# EAGLE design Sleep Lamp (EAGLE 8.2.2)
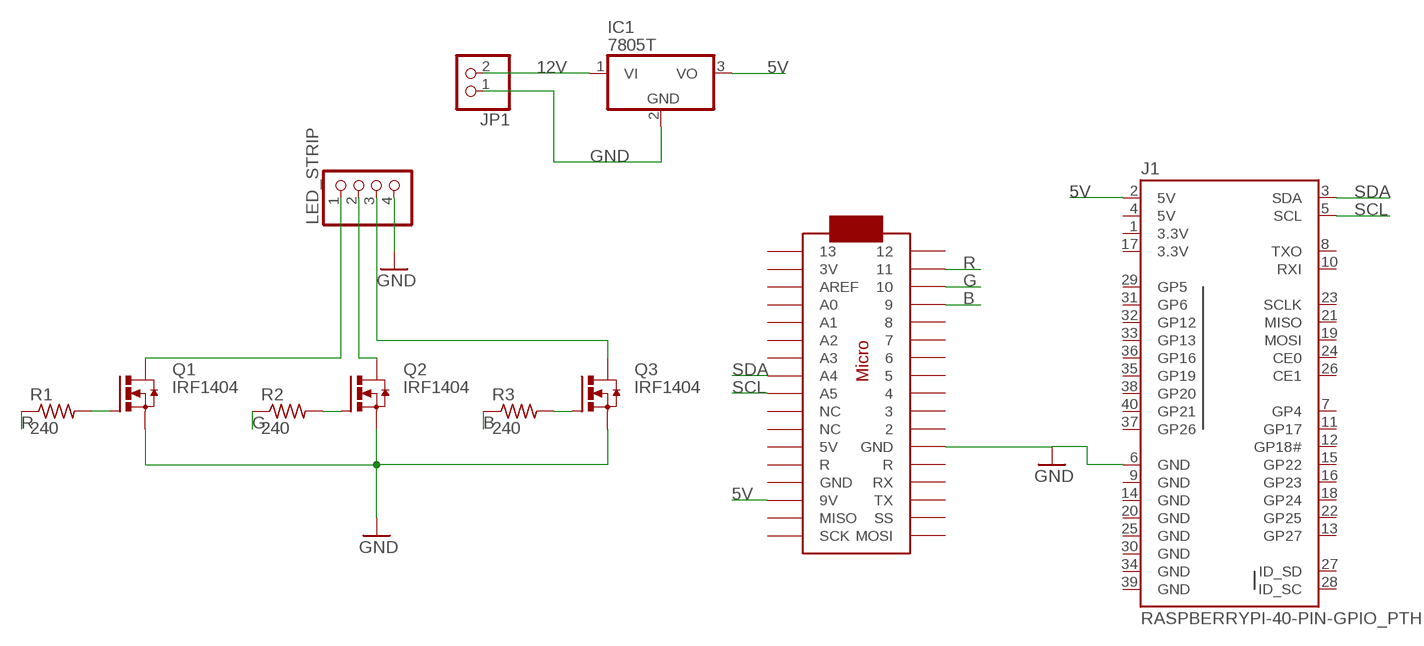
[diagram p0: schematic, sheet 1]

## Parts
IC1  7805T  [TO220H]
J1  RASPBERRYPI-40-PIN-GPIO_PTH  [2X20_SHROUDED]
JP1  PINHD-1X2  [1X02]
LED_STRIP  PINHD-1X4  [1X04]
Q1  IRF1404  IRFI540NPBF  [TO220BH]
Q2  IRF1404  IRFI540NPBF  [TO220BH]
Q3  IRF1404  IRFI540NPBF  [TO220BH]
R1  240  R-US_0204/7  [0204/7]
R2  240  R-US_0204/7  [0204/7]
R3  240  R-US_0204/7  [0204/7]
U$1  ARDUINOMICRO  [ARDUINOMICRO]

## Nets
5V: IC1.3(VO) J1.2(5V) U$1.P$20(9V)
12V: IC1.1(VI) JP1.2
B: R3.1 U$1.P$4
G: R2.1 U$1.P$3
GND: IC1.2(GND) J1.6(GND) JP1.1 LED_STRIP.4 Q1.S Q2.S Q3.S U$1.P$21(GND)
N$1: LED_STRIP.2 Q2.D
N$2: LED_STRIP.3 Q3.D
N$3: LED_STRIP.1 Q1.D
N$4: Q1.G R1.2
N$5: Q2.G R2.2
N$6: Q3.G R3.2
R: R1.1 U$1.P$2
SCL: J1.5(SCL) U$1.P$26(A5)
SDA: J1.3(SDA) U$1.P$27(A4)
Unconnected: J1.7(GP4) J1.8(TXO) J1.10(RXI) J1.11(GP17) J1.12(GP18#) J1.13(GP27) J1.15(GP22) J1.16(GP23) J1.18(GP24) J1.19(MOSI) J1.21(MISO) J1.22(GP25) J1.23(SCLK) J1.24(CE0) J1.26(CE1) J1.27(ID_SD) J1.28(ID_SC) J1.29(GP5) J1.31(GP6) J1.32(GP12) J1.33(GP13) J1.35(GP19) J1.36(GP16) J1.37(GP26) J1.38(GP20) J1.40(GP21) U$1.P$1 U$1.P$5 U$1.P$6 U$1.P$7 U$1.P$8 U$1.P$9 U$1.P$10 U$1.P$11 U$1.P$12(GND) U$1.P$13(R) U$1.P$14(RX) U$1.P$15(TX) U$1.P$16(SS) U$1.P$17(MOSI) U$1.P$18(SCK) U$1.P$19(MISO) U$1.P$22(R) U$1.P$23(5V) U$1.P$24(NC) U$1.P$25(NC) U$1.P$28(A3) U$1.P$29(A2) U$1.P$30(A1) U$1.P$31(A0) U$1.P$32(AREF) U$1.P$33(3V) U$1.P$34

## Power pins joined to a net without a drawn wire
3.3V: J1.1(3.3V) J1.17(3.3V)
5V: J1.4(5V)
GND: J1.9(GND) J1.14(GND) J1.20(GND) J1.25(GND) J1.30(GND) J1.34(GND) J1.39(GND)

## Library data of the parts
IC1 = linear:78*: Positive VOLTAGE REGULATOR Source: http://cache.national.com/ds/LM/LM78L05.pdf http://www.fairchildsemi.com/ds/LM/LM7805.pdf
J1 = SparkFun-Connectors:RASPBERRYPI-40-PIN-GPIO: Raspberry Pi GPIO Header 2x20 pin connector, as found on B, B+, A+ models. Both shrouded PTH and SMT versions available. SparkFun Products: GPIO Shrouded Header <https://www.sparkfun.com/products/13054>- PTH SparkFun Pi Wedge (Preassembled) <https://www.sparkfun.com/products/13717>; PROD_ID: CONN-12263; SF_ID: PRT-13054
JP1 = pinhead:PINHD-1X2: PIN HEADER
LED_STRIP = pinhead:PINHD-1X4: PIN HEADER
Q1-Q3 = transistor-power:IRFI540NPBF: HEXFET Power MOISFET VDSS = 100V, RDS(on) = 0.052 Ohm, ID = 20A, VGS(th) = 2.0 -- 4.0V Source: http://www.irf.com/product-info/datasheets/data/irfi540npbf.pdf
R1-R3 = adafruit:R-US_: RESISTOR, American symbol
U$1 = adafruit:ARDUINOMICRO

## Board
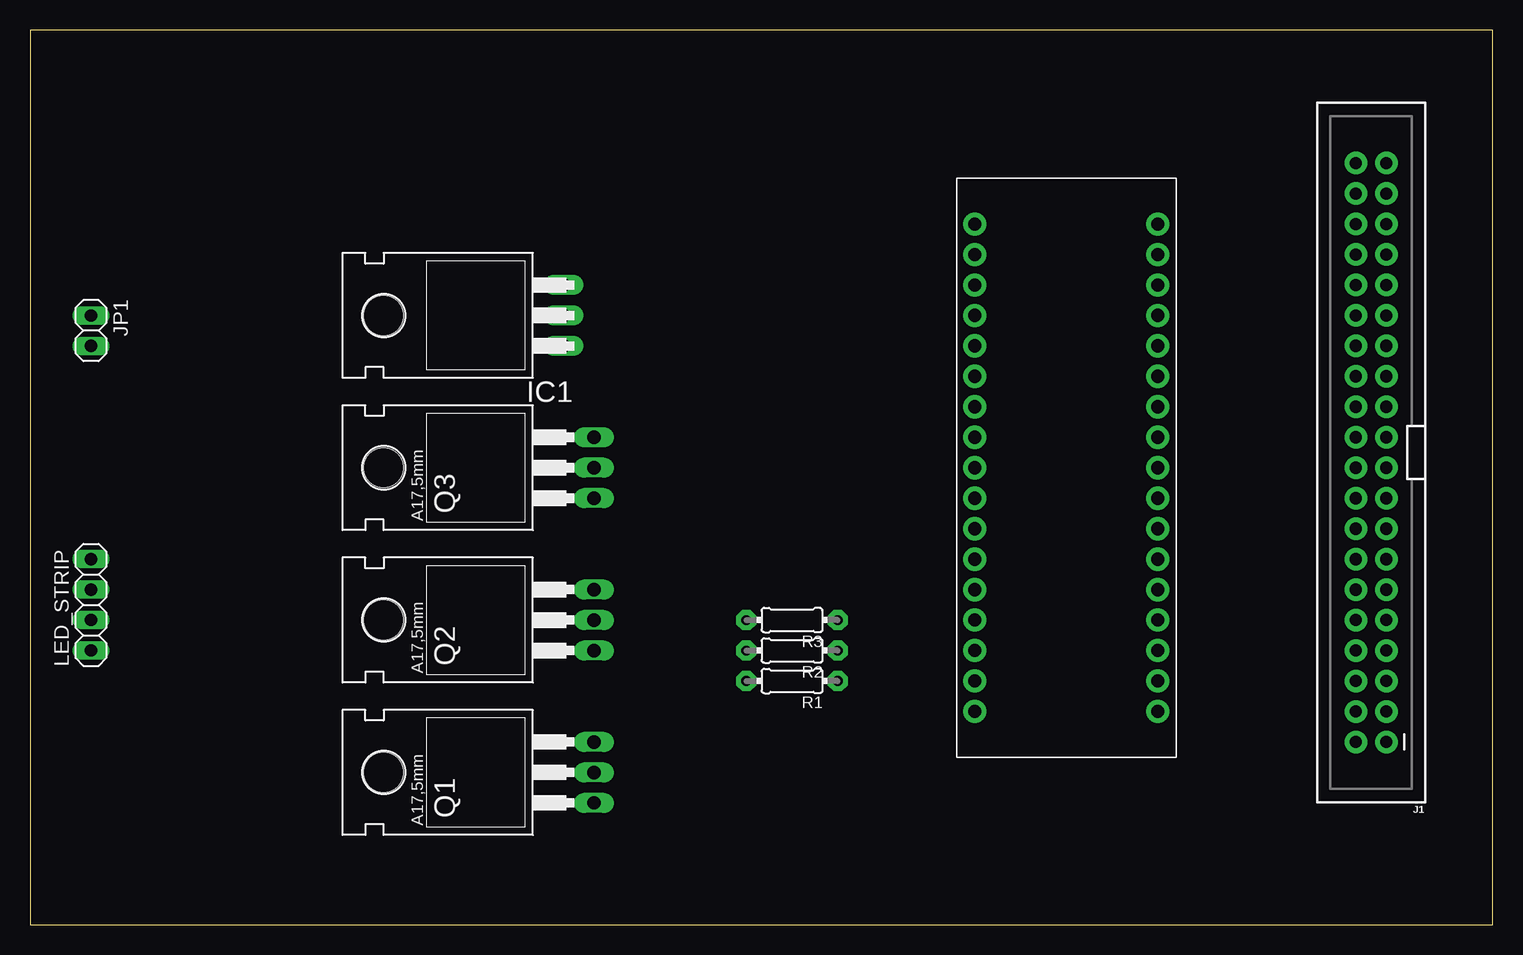
[diagram p1: board, top side]
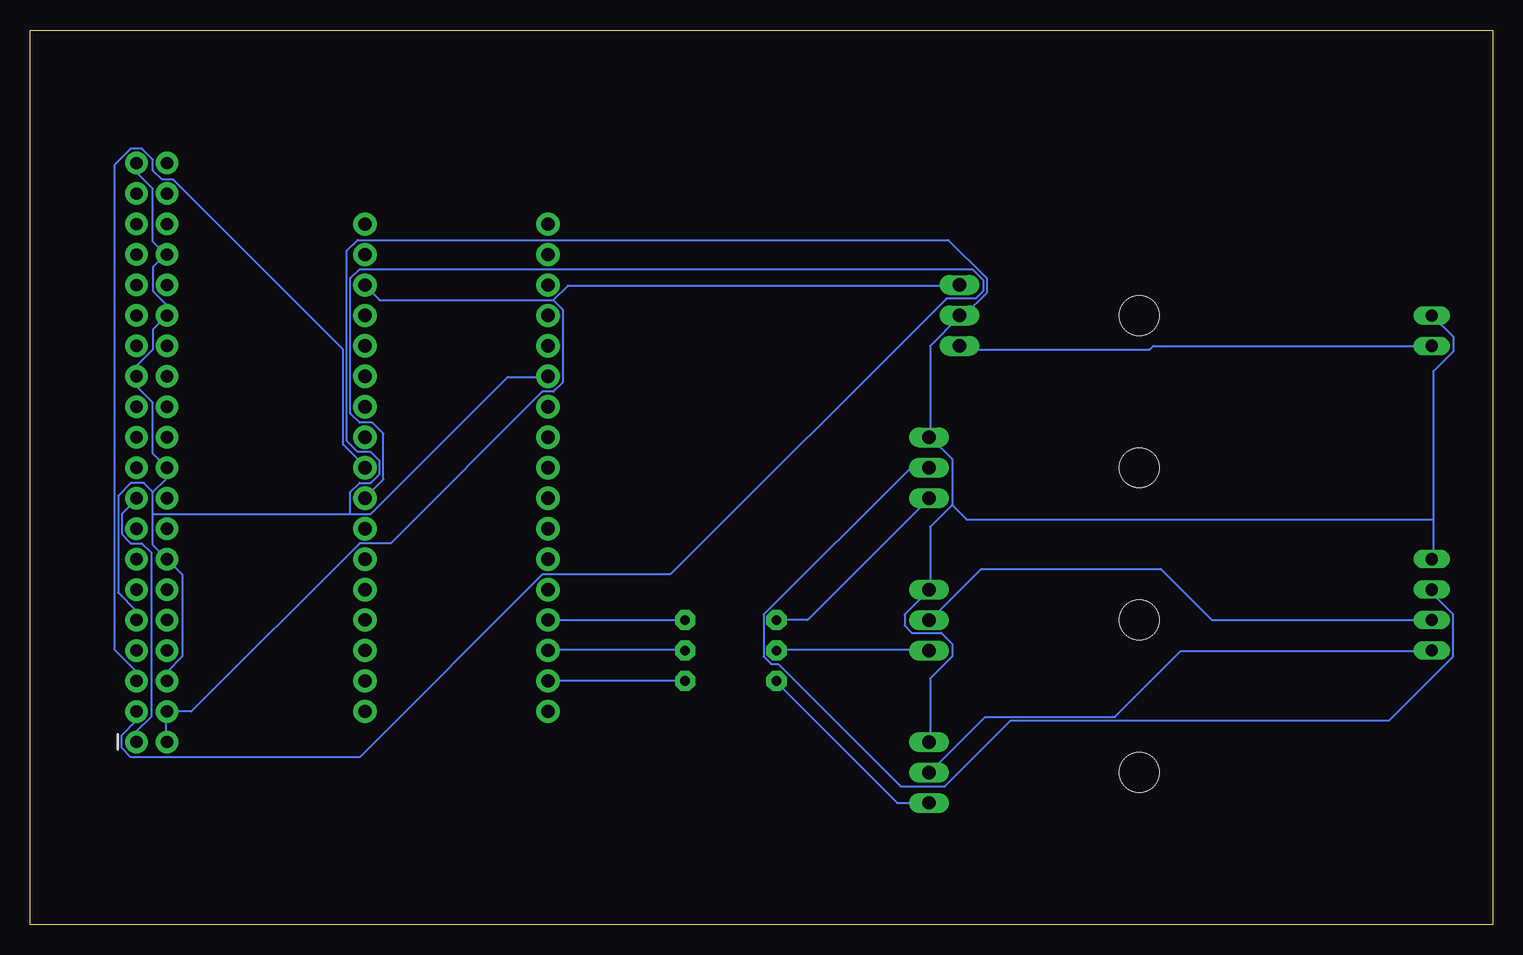
[diagram p2: board, bottom side, seen from below]

Size 121.9 x 74.6 mm. Coordinates in mm from the lower left corner, seen from the top.
Outline: 0,0 121.9,0 121.9,74.6 0,74.6 0,0
Copper layers (1*16): Top 0.035mm / dielectric 1.5mm / Bottom 0.035mm
Design rules "default": minimum track width 6mil, minimum drill 0.35mm, track to track 6mil, track to pad 6mil, pad to pad 6mil, via to via 6mil, smd to smd 6mil, copper to edge 40mil, drill to drill 6mil, minimum pad ring 10mil, minimum via ring 8mil, stop-mask expansion 4mil, vias tented up to drill 0mil, thermal gap 10mil

### Footprints (pad centres in the part's own frame; a part is rotated, then mirrored left to right if it is on the bottom)
TO220H = drill 1.118 long: 1 -2.54,-10.16; 2 0,-10.16; 3 2.54,-10.16 | hole 3.302: 0,4.826
2X20_SHROUDED = drill 1.016 pad 1.88: 1 -1.27,24.13; 2 1.27,24.13; 3 -1.27,21.59; 4 1.27,21.59; 5 -1.27,19.05; 6 1.27,19.05; 7 -1.27,16.51; 8 1.27,16.51; 9 -1.27,13.97; 10 1.27,13.97; 11 -1.27,11.43; 12 1.27,11.43; 13 -1.27,8.89; 14 1.27,8.89; 15 -1.27,6.35; 16 1.27,6.35; 17 -1.27,3.81; 18 1.27,3.81; 19 -1.27,1.27; 20 1.27,1.27; 21 -1.27,-1.27; 22 1.27,-1.27; 23 -1.27,-3.81; 24 1.27,-3.81; 25 -1.27,-6.35; 26 1.27,-6.35; 27 -1.27,-8.89; 28 1.27,-8.89; 29 -1.27,-11.43; 30 1.27,-11.43; 31 -1.27,-13.97; 32 1.27,-13.97; 33 -1.27,-16.51; 34 1.27,-16.51; 35 -1.27,-19.05; 36 1.27,-19.05; 37 -1.27,-21.59; 38 1.27,-21.59; 39 -1.27,-24.13; 40 1.27,-24.13
1X02 = drill 1.016 long: 1 -1.27,0; 2 1.27,0
1X04 = drill 1.016 long: 1 -3.81,0; 2 -1.27,0; 3 1.27,0; 4 3.81,0
TO220BH = drill 1.118 long: D 0,-6.35; G -2.54,-6.35; S 2.54,-6.35 | hole 3.302: 0,11.176
0204/7 = drill 0.813 pad 1.676 octagon: 1 -3.81,0; 2 3.81,0
ARDUINOMICRO = drill 1.1 pad 1.93: P$1 -20.32,7.62; P$2 -17.78,7.62; P$3 -15.24,7.62; P$4 -12.7,7.62; P$5 -10.16,7.62; P$6 -7.62,7.62; P$7 -5.08,7.62; P$8 -2.54,7.62; P$9 0,7.62; P$10 2.54,7.62; P$11 5.08,7.62; P$12 12.7,-7.62; P$13 10.16,-7.62; P$14 12.7,7.62; P$15 15.24,7.62; P$16 17.78,7.62; P$17 20.32,7.62; P$18 20.32,-7.62; P$19 17.78,-7.62; P$20 15.24,-7.62; P$21 7.62,7.62; P$22 10.16,7.62; P$23 7.62,-7.62; P$24 5.08,-7.62; P$25 2.54,-7.62; P$26 0,-7.62; P$27 -2.54,-7.62; P$28 -5.08,-7.62; P$29 -7.62,-7.62; P$30 -10.16,-7.62; P$31 -12.7,-7.62; P$32 -15.24,-7.62; P$33 -17.78,-7.62; P$34 -20.32,-7.62

### Placement (x,y rotation side)
IC1  34.29,50.8 90 top
J1  111.76,39.37 180 top
JP1  5.08,49.53 270 top
LED_STRIP  5.08,26.67 90 top
Q1  40.64,12.7 90 top
Q2  40.64,25.4 90 top
Q3  40.64,38.1 90 top
R1  63.5,20.32 180 top
R2  63.5,22.86 180 top
R3  63.5,25.4 180 top
U$1  86.36,38.1 90 top

### Tracks (layer width: path | path; a pad name or v marks a point on that pad's centre or on a via)
3.3V
  Bottom 0.152: J1.1 113.03,16.1 111.81,17.32 111.81,31.04 112.57,31.8 113.49,31.8 114.25,32.56 114.25,34.24 113.03,35.46 J1.17
5V
  Bottom 0.152: J1.2 110.59,15.34 110.59,17.78 J1.4 108.46,17.78 94.44,31.8 91.85,31.8 79.2,44.45 78.28,44.45 77.52,45.21 77.52,51.31 78.28,52.07 | 78.28,52.07 77.06,53.29 44.45,53.29 IC1.3 | 78.28,52.07 92.76,52.07 93.98,53.29 U$1.P$20
12V
  Bottom 0.152: JP1.2 28.3,48.26 28.6,47.95 44.15,47.95 IC1.1
B
  Bottom 0.152: U$1.P$4 R3.1
G
  Bottom 0.152: R2.1 67.31,22.96 78.74,22.96 U$1.P$3
GND
  Bottom 0.152: 4.98,33.78 4.98,46.13 3.3,47.8 3.3,49.02 JP1.1 | 4.98,33.78 4.98,30.58 LED_STRIP.4 | Q1.S 46.89,15.34 46.89,20.52 45.06,22.35 45.06,23.42 45.97,24.33 48.41,24.33 49.02,24.94 49.02,25.86 47.04,27.84 Q2.S 46.89,27.99 46.89,33.17 45.06,35 | 46.89,40.64 46.89,48.26 44.45,50.7 IC1.2 44.45,50.85 43.99,50.85 42.16,52.68 42.16,53.9 45.36,57.1 94.59,57.1 95.5,56.19 95.5,40.34 94.59,39.42 93.52,39.42 92.76,38.66 92.76,37.59 93.52,36.83 94.44,36.83 95.2,36.07 95.2,34.24 | 45.06,35 45.06,38.81 46.89,40.64 | 46.89,40.64 Q3.S | 4.98,33.78 43.84,33.78 45.06,35 | 110.59,55.88 111.66,54.81 111.66,52.83 110.59,51.77 110.59,50.85 J1.30 111.66,49.63 111.66,47.95 113.03,46.58 J1.25 113.03,44.91 111.66,43.54 111.66,39.27 J1.20 110.59,38.05 110.59,37.13 111.66,36.07 | J1.39 113.03,62.74 111.66,61.37 111.66,56.95 110.59,55.88 | 110.59,55.88 J1.34 | J1.6 110.44,20.37 110.44,21.13 109.22,22.35 109.22,29.21 J1.14 111.66,31.65 111.66,34.24 | 111.66,34.24 111.66,36.07 | J1.9 113.03,26.16 114.55,27.69 114.55,35.76 113.49,36.83 112.42,36.83 111.66,36.07 | 111.66,34.24 95.2,34.24 | 95.2,34.24 93.52,34.24 82.09,45.67 78.74,45.67 U$1.P$21
N$1
  Bottom 0.152: LED_STRIP.2 23.42,25.4 27.69,29.67 42.62,29.67 46.89,25.4 Q2.D
N$2
  Bottom 0.152: LED_STRIP.3 4.98,27.84 4.98,27.53 3.3,25.86 3.3,22.35 8.64,17.02 40.18,17.02 45.67,11.53 49.33,11.53 59.54,21.74 60.15,21.74 60.76,22.35 60.76,25.86 48.57,38.05 47.04,38.05 Q3.D
N$3
  Bottom 0.152: LED_STRIP.1 5.13,22.81 26.01,22.81 31.5,17.32 42.32,17.32 46.89,12.75 Q1.D
N$4
  Bottom 0.152: Q1.G 49.63,10.16 59.69,20.22 R1.2
N$5
  Bottom 0.152: Q2.G 47.04,22.96 59.69,22.96 R2.2
N$6
  Bottom 0.152: R3.2 57.1,25.4 47.04,35.46 Q3.G
R
  Bottom 0.152: R1.1 67.31,20.37 78.74,20.37 U$1.P$2
SCL
  Bottom 0.152: J1.5 113.03,21.13 114.86,22.96 114.86,63.35 113.49,64.72 112.57,64.72 111.66,63.8 111.66,62.89 110.9,62.13 109.98,62.13 95.81,47.95 95.81,40.03 93.98,38.2 U$1.P$26
SDA
  Bottom 0.152: J1.3 113.03,17.02 114.25,15.8 114.25,14.73 113.49,13.97 94.44,13.97 79.2,29.21 68.53,29.21 45.52,52.22 43.08,52.22 42.47,52.83 42.47,53.75 43.38,54.66 94.44,54.66 95.2,53.9 95.2,42.62 94.44,41.86 93.37,41.86 92.46,40.95 92.46,37.13 93.98,35.61 U$1.P$27